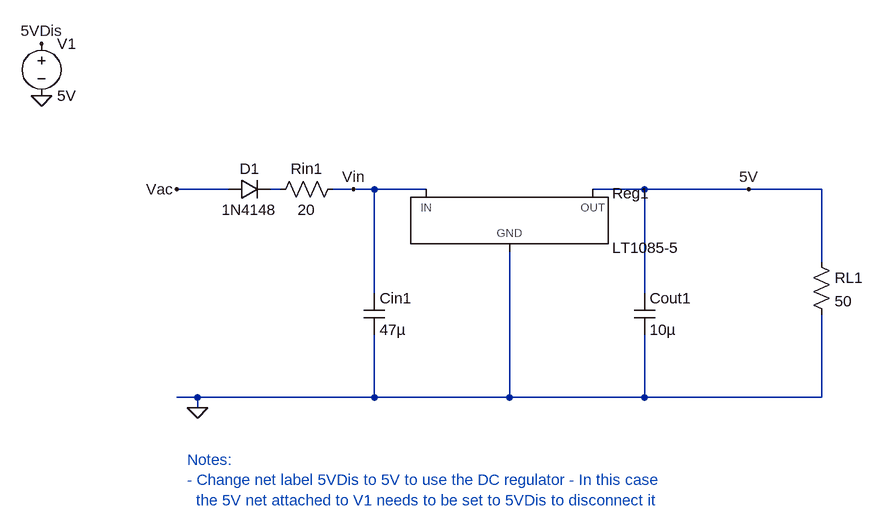
[diagram p0: schematic Regulator5V.asc]
Regulator5V.asc, the LTspice schematic file:
Version 4
SHEET 1 996 740
WIRE 16 32 -64 32
WIRE 96 32 80 32
WIRE 208 32 176 32
WIRE 240 32 208 32
WIRE 320 32 240 32
WIRE 656 32 576 32
WIRE 816 32 656 32
WIRE 928 32 816 32
WIRE 928 144 928 32
WIRE 240 192 240 32
WIRE 656 192 656 32
WIRE -32 352 -64 352
WIRE 240 352 240 256
WIRE 240 352 -32 352
WIRE 448 352 448 128
WIRE 448 352 240 352
WIRE 656 352 656 256
WIRE 656 352 448 352
WIRE 928 352 928 224
WIRE 928 352 656 352
WIRE -32 368 -32 352
FLAG -32 368 0
FLAG -64 32 Vac
FLAG 816 32 5V
FLAG 208 32 Vin
FLAG -272 -112 0
FLAG -272 -192 5VDis
SYMBOL PowerProducts/LT1085-5 448 32 R0
SYMATTR InstName Reg1
SYMBOL res 912 128 R0
SYMATTR InstName RL1
SYMATTR Value 50
SYMBOL res 192 16 R90
WINDOW 0 0 56 VBottom 2
WINDOW 3 32 56 VTop 2
SYMATTR InstName Rin1
SYMATTR Value 20
SYMBOL diode 16 48 R270
WINDOW 0 32 32 VTop 2
WINDOW 3 0 32 VBottom 2
SYMATTR InstName D1
SYMATTR Value 1N4148
SYMBOL cap 224 192 R0
SYMATTR InstName Cin1
SYMATTR Value 47µ
SYMATTR SpiceLine Rser=0.001
SYMBOL cap 640 192 R0
SYMATTR InstName Cout1
SYMATTR Value 10µ
SYMATTR SpiceLine Rser=0.001
SYMBOL voltage -272 -208 R0
SYMATTR InstName V1
SYMATTR Value 5V
TEXT -48 448 Left 2 ;Notes: \n- Change net label 5VDis to 5V to use the DC regulator - In this case \n  the 5V net attached to V1 needs to be set to 5VDis to disconnect it

The netlist it stands for:
* Regulator5V.asc
XReg1 0 5V Vin LT1085-5  ; pins GND OUT IN
RL1 5V 0 50
Rin1 Vin N001 20
D1 Vac N001 1N4148
Cin1 Vin 0 47µ Rser=0.001
Cout1 5V 0 10µ Rser=0.001
V1 5VDis 0 5V
.model D D
.lib standard.dio
* Notes:
* - Change net label 5VDis to 5V to use the DC regulator - In this case
*   the 5V net attached to V1 needs to be set to 5VDis to disconnect it
.backanno
.end